# Altium schematic sheet HIVE_BOARD_USB.SchDoc
size Tabloid; SheetNumber: 8; SheetTotal: 12; Sheet_Name: USB Hub; Size: 11x17
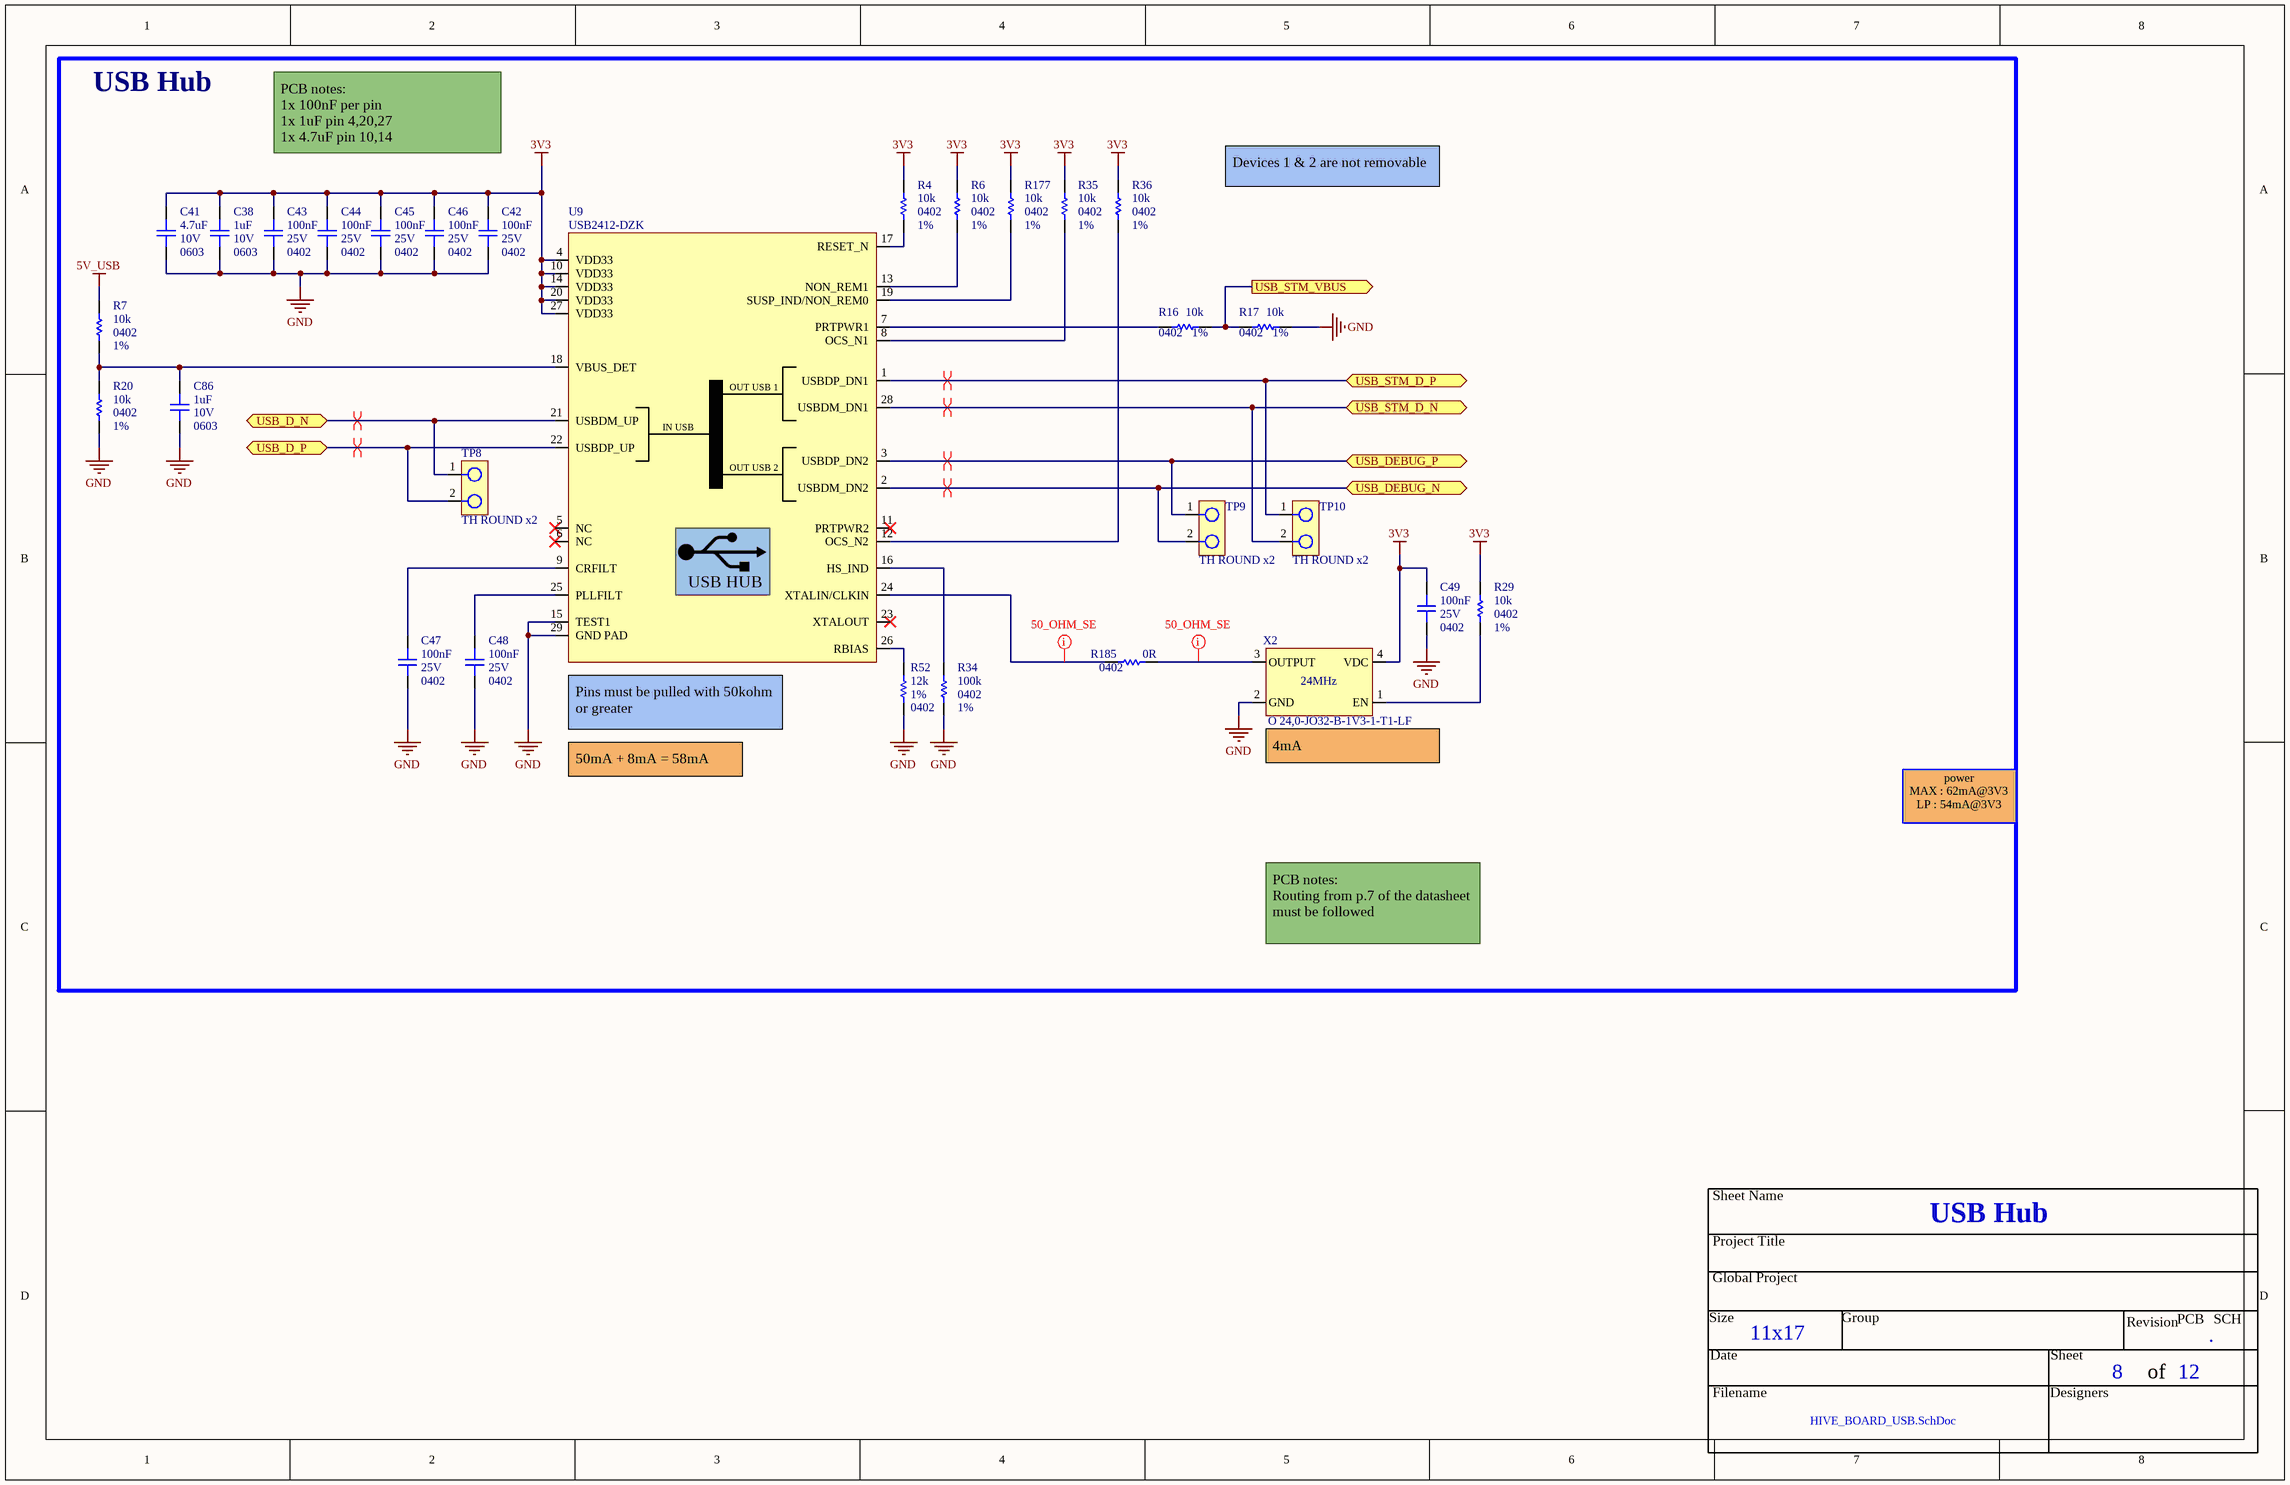
[diagram p0: HIVE_BOARD_USB.SchDoc]

## Parts
C38  value 1uF  Package: 0603  Voltage Rating: 10V  [CAP_CER_0603]  (hidden comment: C0603C105K8PACTU)
C41  value 4.7uF  Package: 0603  Voltage Rating: 10V  [CAP_CER_0603]  (hidden comment: CL10A475KP8NNNC)
C42  value 100nF  Package: 0402  Voltage Rating: 25V  [CAP_CER_0402]  (hidden comment: CGA2B3X7R1E104K050BB)
C43  value 100nF  Package: 0402  Voltage Rating: 25V  [CAP_CER_0402]  (hidden comment: CGA2B3X7R1E104K050BB)
C44  value 100nF  Package: 0402  Voltage Rating: 25V  [CAP_CER_0402]  (hidden comment: CGA2B3X7R1E104K050BB)
C45  value 100nF  Package: 0402  Voltage Rating: 25V  [CAP_CER_0402]  (hidden comment: CGA2B3X7R1E104K050BB)
C46  value 100nF  Package: 0402  Voltage Rating: 25V  [CAP_CER_0402]  (hidden comment: CGA2B3X7R1E104K050BB)
C47  value 100nF  Package: 0402  Voltage Rating: 25V  [CAP_CER_0402]  (hidden comment: CGA2B3X7R1E104K050BB)
C48  value 100nF  Package: 0402  Voltage Rating: 25V  [CAP_CER_0402]  (hidden comment: CGA2B3X7R1E104K050BB)
C49  value 100nF  Package: 0402  Voltage Rating: 25V  [CAP_CER_0402]  (hidden comment: CGA2B3X7R1E104K050BB)
C86  value 1uF  Package: 0603  Voltage Rating: 10V  [CAP_CER_0603]  (hidden comment: C0603C105K8PACTU)
R4  value 10k  Tolerance: 1%  Package: 0402  [RES_0402]  (hidden comment: RC0402FR-0710KL)
R6  value 10k  Tolerance: 1%  Package: 0402  [RES_0402]  (hidden comment: RC0402FR-0710KL)
R7  value 10k  Tolerance: 1%  Package: 0402  [RES_0402]  (hidden comment: RC0402FR-0710KL)
R16  value 10k  Tolerance: 1%  Package: 0402  [RES_0402]  (hidden comment: RC0402FR-0710KL)
R17  value 10k  Tolerance: 1%  Package: 0402  [RES_0402]  (hidden comment: RC0402FR-0710KL)
R20  value 10k  Tolerance: 1%  Package: 0402  [RES_0402]  (hidden comment: RC0402FR-0710KL)
R29  value 10k  Tolerance: 1%  Package: 0402  [RES_0402]  (hidden comment: RC0402FR-0710KL)
R34  value 100k  Tolerance: 1%  Package: 0402  [RES_0402]  (hidden comment: RC0402FR-07100KL)
R35  value 10k  Tolerance: 1%  Package: 0402  [RES_0402]  (hidden comment: RC0402FR-0710KL)
R36  value 10k  Tolerance: 1%  Package: 0402  [RES_0402]  (hidden comment: RC0402FR-0710KL)
R52  value 12k  Tolerance: 1%  Package: 0402  [RES_0402]  (hidden comment: RC0402FR-0712KL)
R177  value 10k  Tolerance: 1%  Package: 0402  [RES_0402]  (hidden comment: RC0402FR-0710KL)
R185  value 0R  Package: 0402  [RES_0402]  (hidden comment: RC0402FR-070RL)
TP8  TH ROUND x2  [TPO_TH_ROUND_0.7mm_DOUBLE]  (no BOM)
TP9  TH ROUND x2  [TPO_TH_ROUND_0.7mm_DOUBLE]  (no BOM)
TP10  TH ROUND x2  [TPO_TH_ROUND_0.7mm_DOUBLE]  (no BOM)
U9  USB2412-DZK  [USB_USB2412-DZK]
X2  O 24,0-JO32-B-1V3-1-T1-LF  [OSC_O 24,0-JO32-B-1V3-1-T1-LF]

## Blocks framed on the sheet
USB Hub: C38 C41-C49 C86 R4 R6 R7 R16 R17 R20 R29 R34-R36 R52 R177 R185 TP8-TP10 U9 X2

## Ports
USB_D_N (bidir), USB_D_P (bidir), USB_DEBUG_N (bidir), USB_DEBUG_P (bidir), USB_STM_D_N (bidir), USB_STM_D_P (bidir), USB_STM_VBUS (out)

## Nets
3V3: C38.1 C41.2 C42.2 C43.2 C44.2 C45.2 C46.2 C49.2 R4.1 R6.1 R29.1 R35.1 R36.1 R177.1 U9.4(VDD33) U9.10(VDD33) U9.14(VDD33) U9.20(VDD33) U9.27(VDD33) X2.4(VDC)
5V_USB: R7.1
GND: C38.2 C41.1 C42.1 C43.1 C44.1 C45.1 C46.1 C47.1 C48.1 C49.1 C86.2 R17.2 R20.2 R34.2 R52.1 U9.15(TEST1) U9.29(GND_PAD) X2.2(GND)
USB_D_N: TP8.1 U9.21(USBDM_UP) ; port USB_D_N
USB_D_P: TP8.2 U9.22(USBDP_UP) ; port USB_D_P
USB_DEBUG_N: TP9.2 U9.2(USBDM_DN2) ; port USB_DEBUG_N
USB_DEBUG_P: TP9.1 U9.3(USBDP_DN2) ; port USB_DEBUG_P
USB_STM_D_N: TP10.2 U9.28(USBDM_DN1) ; port USB_STM_D_N
USB_STM_D_P: TP10.1 U9.1(USBDP_DN1) ; port USB_STM_D_P
USB_STM_VBUS: R16.2 R17.1 ; port USB_STM_VBUS
NetC47_2: C47.2 U9.9(CRFILT)
NetC48_2: C48.2 U9.25(PLLFILT)
NetC86_1: C86.1 R7.2 R20.1 U9.18(VBUS_DET)
NetR4_2: R4.2 U9.17(RESET_N)
NetR6_2: R6.2 U9.13(NON_REM1)
NetR16_1: R16.1 U9.7(PRTPWR1)
NetR29_2: R29.2 X2.1(EN)
NetR34_1: R34.1 U9.16(HS_IND)
NetR35_2: R35.2 U9.8(OCS_N1)
NetR36_2: R36.2 U9.12(OCS_N2)
NetR52_2: R52.2 U9.26(RBIAS)
NetR177_2: R177.2 U9.19(SUSP_IND/NON_REM0)
NetR185_1: R185.1 X2.3(OUTPUT)
NetR185_2: R185.2 U9.24(XTALIN/CLKIN)

Not connected (* = marked no-connect by the designer): U9 5(NC)* 6(NC)* 11(PRTPWR2)* 23(XTALOUT)*

## Layout directives
differential pair; differential pair class DIFF_90: USB_D_N, USB_D_P, USB_DEBUG_N, USB_DEBUG_P, USB_STM_D_N, USB_STM_D_P
net class SE_50: NetR185_1, NetR185_2

## Notes on the sheet
- PCB notes:
  1x 100nF per pin
  1x 1uF pin 4,20,27
  1x 4.7uF pin 10,14
- Devices 1 & 2 are not removable
- (near U9) Pins must be pulled with 50kohm or greater
- (near X2) 4mA
- 50mA + 8mA = 58mA
- power
  MAX : 62mA@3V3
  LP : 54mA@3V3
- PCB notes:
  Routing from p.7 of the datasheet must be followed
- Sheet Name
- Project Title
- Global Project
- Size
- Date
- Group
- Sheet
- Revision
- of
- PCB
- .
- SCH
- Filename
- Designers
- (in symbol USB_USB2412-DZK) OUT USB 1; IN USB; OUT USB 2; USB HUB

## Library data of the parts
C38 C86 = CAP_CER_C0603C105K8PACTU: CAP - CER 1uF 10V 10% X5R - 0603; Manufacturer #1: KEMET; GRAMS Lib Spec: 2.8; Magnetic Material: Unknown; Polarized: NO; Tolerance: 10%; Current Rating: *; Power Max: *; HelpURL: https://content.kemet.com/datasheets/KEM_C1006_X5R_SMD.pdf; CreatedBy/Date: Hubert Dube - 21/07/20; VerifiedBy: Louis-Daniel Gaulin - 21/07/20; Temperature: -55°C ~ 85°C; Manufacturer #2: *; Assembly Type: SMD; Part Number #2: *; Part Number #1: C0603C105K8PACTU; Cryo: UNKNOWN; Supplier 1: Digi-Key; Supplier Part Number 1: 399-3118-1-ND
C41 = CAP_CER_CL10A475KP8NNNC: 4.7µF ±10% 10V Ceramic Capacitor X5R 0603; Manufacturer #1: Samsung Electro-Mechanics; GRAMS Lib Spec: 2.8; Magnetic Material: Unknown; Polarized: No; Tolerance: 10%; Current Rating: *; Power Max: *; HelpURL: https://www.samsungsem.com/resources/file/global/support/product_catalog/MLCC.pdf; CreatedBy/Date: Hubert Dube - 25/02/2021; VerifiedBy: Philippe Arsenault/2021-03-14; Temperature: -55°C ~ 85°C; Manufacturer #2: *; Note: *; Assembly Type: SMD; Part Number #2: *; Part Number #1: CL10A475KP8NNNC; Cryo: UNKNOWN; Supplier 1: Digi-Key; Supplier Part Number 1: 1276-1044-1-ND
C42-C49 = CAP_CER_CGA2B3X7R1E104K050BB: CAP - CER 0.1µF 10% 25V X7R - 0402; Manufacturer #1: TDK Corporation; GRAMS Lib Spec: 2.8; Magnetic Material: Unknown; Polarized: NO; Assembly Type: SMD; CreatedBy/Date: Nicolas Roy 2018-11-07; Current Rating: *; HelpURL: https://product.tdk.com/info/en/catalog/datasheets/mlcc_automotive_general_en.pdf; Manufacturer #2: *; Note: *; Part Number #1: CGA2B3X7R1E104K050BB; Part Number #2: *; Power Max: *; Temperature: -55°C ~ 125°C; Tolerance: 10%; VerifiedBy: Nicolas V. (2019-01-22); Supplier 1: Digi-Key; Supplier Part Number 1: 445-6902-1-ND; Cryo: UNKNOWN
R4 R6 R7 R16 R17 R20 R29 R35 R36 R177 = RES_RC0402FR-0710KL: RES - 10K OHMS 1% 1/16W - 0402; Manufacturer #1: Yageo; GRAMS Lib Spec: 2.8; Magnetic Material: UNKNOWN; Polarized: NO; Voltage Rating: 50V; Assembly Type: SMD; CreatedBy/Date: Nicolas V. (2018-11-20); Current Rating: *; HelpURL: http://www.yageo.com/documents/recent/PYu-RC_Group_51_RoHS_L_9.pdf; Manufacturer #2: *; Note: *; Part Number #1: RC0402FR-0710KL; Part Number #2: *; Power Max: 1/16W; Temperature: -55°C ~ 155°C; VerifiedBy: Nicolas V. (2018-11-20); Supplier 1: Digi-Key; Supplier Part Number 1: 311-10.0KLRCT-ND; Cryo: UNKNOWN; Solder Paste Type: UNKNOWN; Stencil Thickness (Recommended): UNKNOWN
R34 = RES_RC0402FR-07100KL: RES - 100K 1% 1/16W - 0402; Manufacturer #1: Yageo; GRAMS Lib Spec: 2.8; Magnetic Material: Unknown; Polarized: No; Voltage Rating: 50V; Assembly Type: SMD; CreatedBy/Date: Keven Deslandes 2018-10-19; Current Rating: *; HelpURL: http://www.yageo.com/documents/recent/PYu-RC_Group_51_RoHS_L_9.pdf; Manufacturer #2: *; Part Number #1: RC0402FR-07100KL; Part Number #2: *; Power Max: 1/16W; Temperature: -55°C ~ 155°C; VerifiedBy: Caroline Paulin - 18/12/2018; Supplier 1: Digi-Key; Supplier Part Number 1: 311-100KLRCT-ND; Cryo: UNKNOWN
R52 = RES_RC0402FR-0712KL: RES - 12k Ohms ±1% 0.063W, 1/16W Chip Resistor 0402 (1005 Metric) Moisture Resistant Thick Film; Manufacturer #1: Yageo; GRAMS Lib Spec: 2.8c; Magnetic Material: Unknown; Polarized: No; Voltage Rating: 50V; Assembly Type: SMD; CreatedBy/Date: Philippe Arsenault/2021-03-11; Current Rating: *; HelpURL: https://www.yageo.com/upload/media/product/productsearch/datasheet/rchip/PYu-RC_Group_51_RoHS_L_11.pdf; Manufacturer #2: *; Note: *; Part Number #1: RC0402FR-0712KL; Part Number #2: *; Power Max: 1/16W; Temperature: -55°C ~ 155°C; VerifiedBy: Hubert Dube - 19/03/2021; Supplier 1: Digi-Key; Supplier Part Number 1: 311-12.0KLRCT-ND
R185 = RES_RC0402FR-070RL: RES - 0R 1/16W 1A  - 0402; Manufacturer #1: Yageo; GRAMS Lib Spec: 2.8; Magnetic Material: Unknown; Polarized: No; Voltage Rating: 50V; Assembly Type: SMD; CreatedBy/Date: Keven Deslandes 2018-09-12; Current Rating: 1A; HelpURL: http://www.yageo.com/documents/recent/PYu-RC_Group_51_RoHS_L_10.pdf; Manufacturer #2: *; Note: *; Part Number #1: RC0402FR-070RL; Part Number #2: *; Power Max: 1/16W; Temperature: -55°C ~ 155°C; VerifiedBy: Caroline Paulin - 27 fév 2019; Supplier 1: Digi-Key; Supplier Part Number 1: 311-0.0LRCT-ND; Cryo: UNKNOWN
TP8-TP10 = TPO_TH_ROUND_0.7mm_DOUBLE: TPO - TH round 0.7mm double - 2-SMD; GRAMS Lib Spec: 2.8; Tolerance: -; Voltage Rating: -; Current Rating: -; Power Max: -; HelpURL: -; CreatedBy/Date: Philippe Arsenault / 20-04-2021; VerifiedBy: Louis-Daniel Gaulin / 29-04-2021; Temperature: -; Package: 2-SMD; Manufacturer #1: -; Manufacturer #2: -; Note: -; Assembly Type: TH; Part Number #2: -; Part Number #1: -; Magnetic Material: -; Polarized: -; Supplier 1: -; Supplier Part Number 1: -
U9 = USB_USB2412-DZK: USB Hub Controller USB 2.0 USB Interface 28-QFN; Manufacturer #1: Microchip Technology; Part Number #1: 638-1114-ND; Value: 2-PORTS; Voltage Rating: 3V ~ 3.6V; GRAMS Lib Spec: 2.7; Magnetic Material: Unknown; Polarized: Yes; Tolerance: *; Current Rating: *; Power Max: *; HelpURL: https://ww1.microchip.com/downloads/en/DeviceDoc/2412.pdf; VerifiedBy: Philippe Arsenault/2021-03-14; Temperature: 0°C ~ 70°C; Package: *; Manufacturer #2: *; Assembly Type: SMD; Part Number #2: *; CreatedBy/Date: Hubert Dube -  12/02/2021; Supplier 1: Digi-Key; Supplier Part Number 1: USB2412-DZK-CT-ND
X2 = OSC_O 24,0-JO32-B-1V3-1-T1-LF: OSC - 24MHz XO (Standard) LVCMOS Oscillator 1.8V ~ 3.3V Enable/Disable 4-SMD, No Lead; Manufacturer #1: Jauch Quartz; Tolerance: ±50ppm; Current Rating: 4mA; Power Max: 13mW; GRAMS Lib Spec: 2.8c; Magnetic Material: Unknown; Polarized: Yes; Value: 24MHz; Voltage Rating: 1.8V ~ 3.3V; HelpURL: https://www.jauch.com/downloadfile/5ef1edcfb8e2f73163c8ce8009ef659d1/jo32-1.8-3.3v.pdf; CreatedBy/Date: Louis-Daniel Gaulin / 13-04-2021; VerifiedBy: Philippe Arsenault/2021-04-14; Temperature: -40°C ~ +85°C; Package: 4-SMD, No Lead; Manufacturer #2: *; Note: *; Assembly Type: SMD; Part Number #2: *; Part Number #1: O 24,0-JO32-B-1V3-1-T1-LF; Cryo: UNKNOWN; Supplier 1: Digi-Key; Supplier Part Number 1: 1908-O240-JO32-B-1V3-1-T1-LFCT-ND